# Altium schematic sheet IN-14 Breakout Board.SchDoc: Direct Drive Breakout for IN-14
size Tabloid; DrawnBy: M. Spinks; Revision: 1.0; SheetNumber: 1
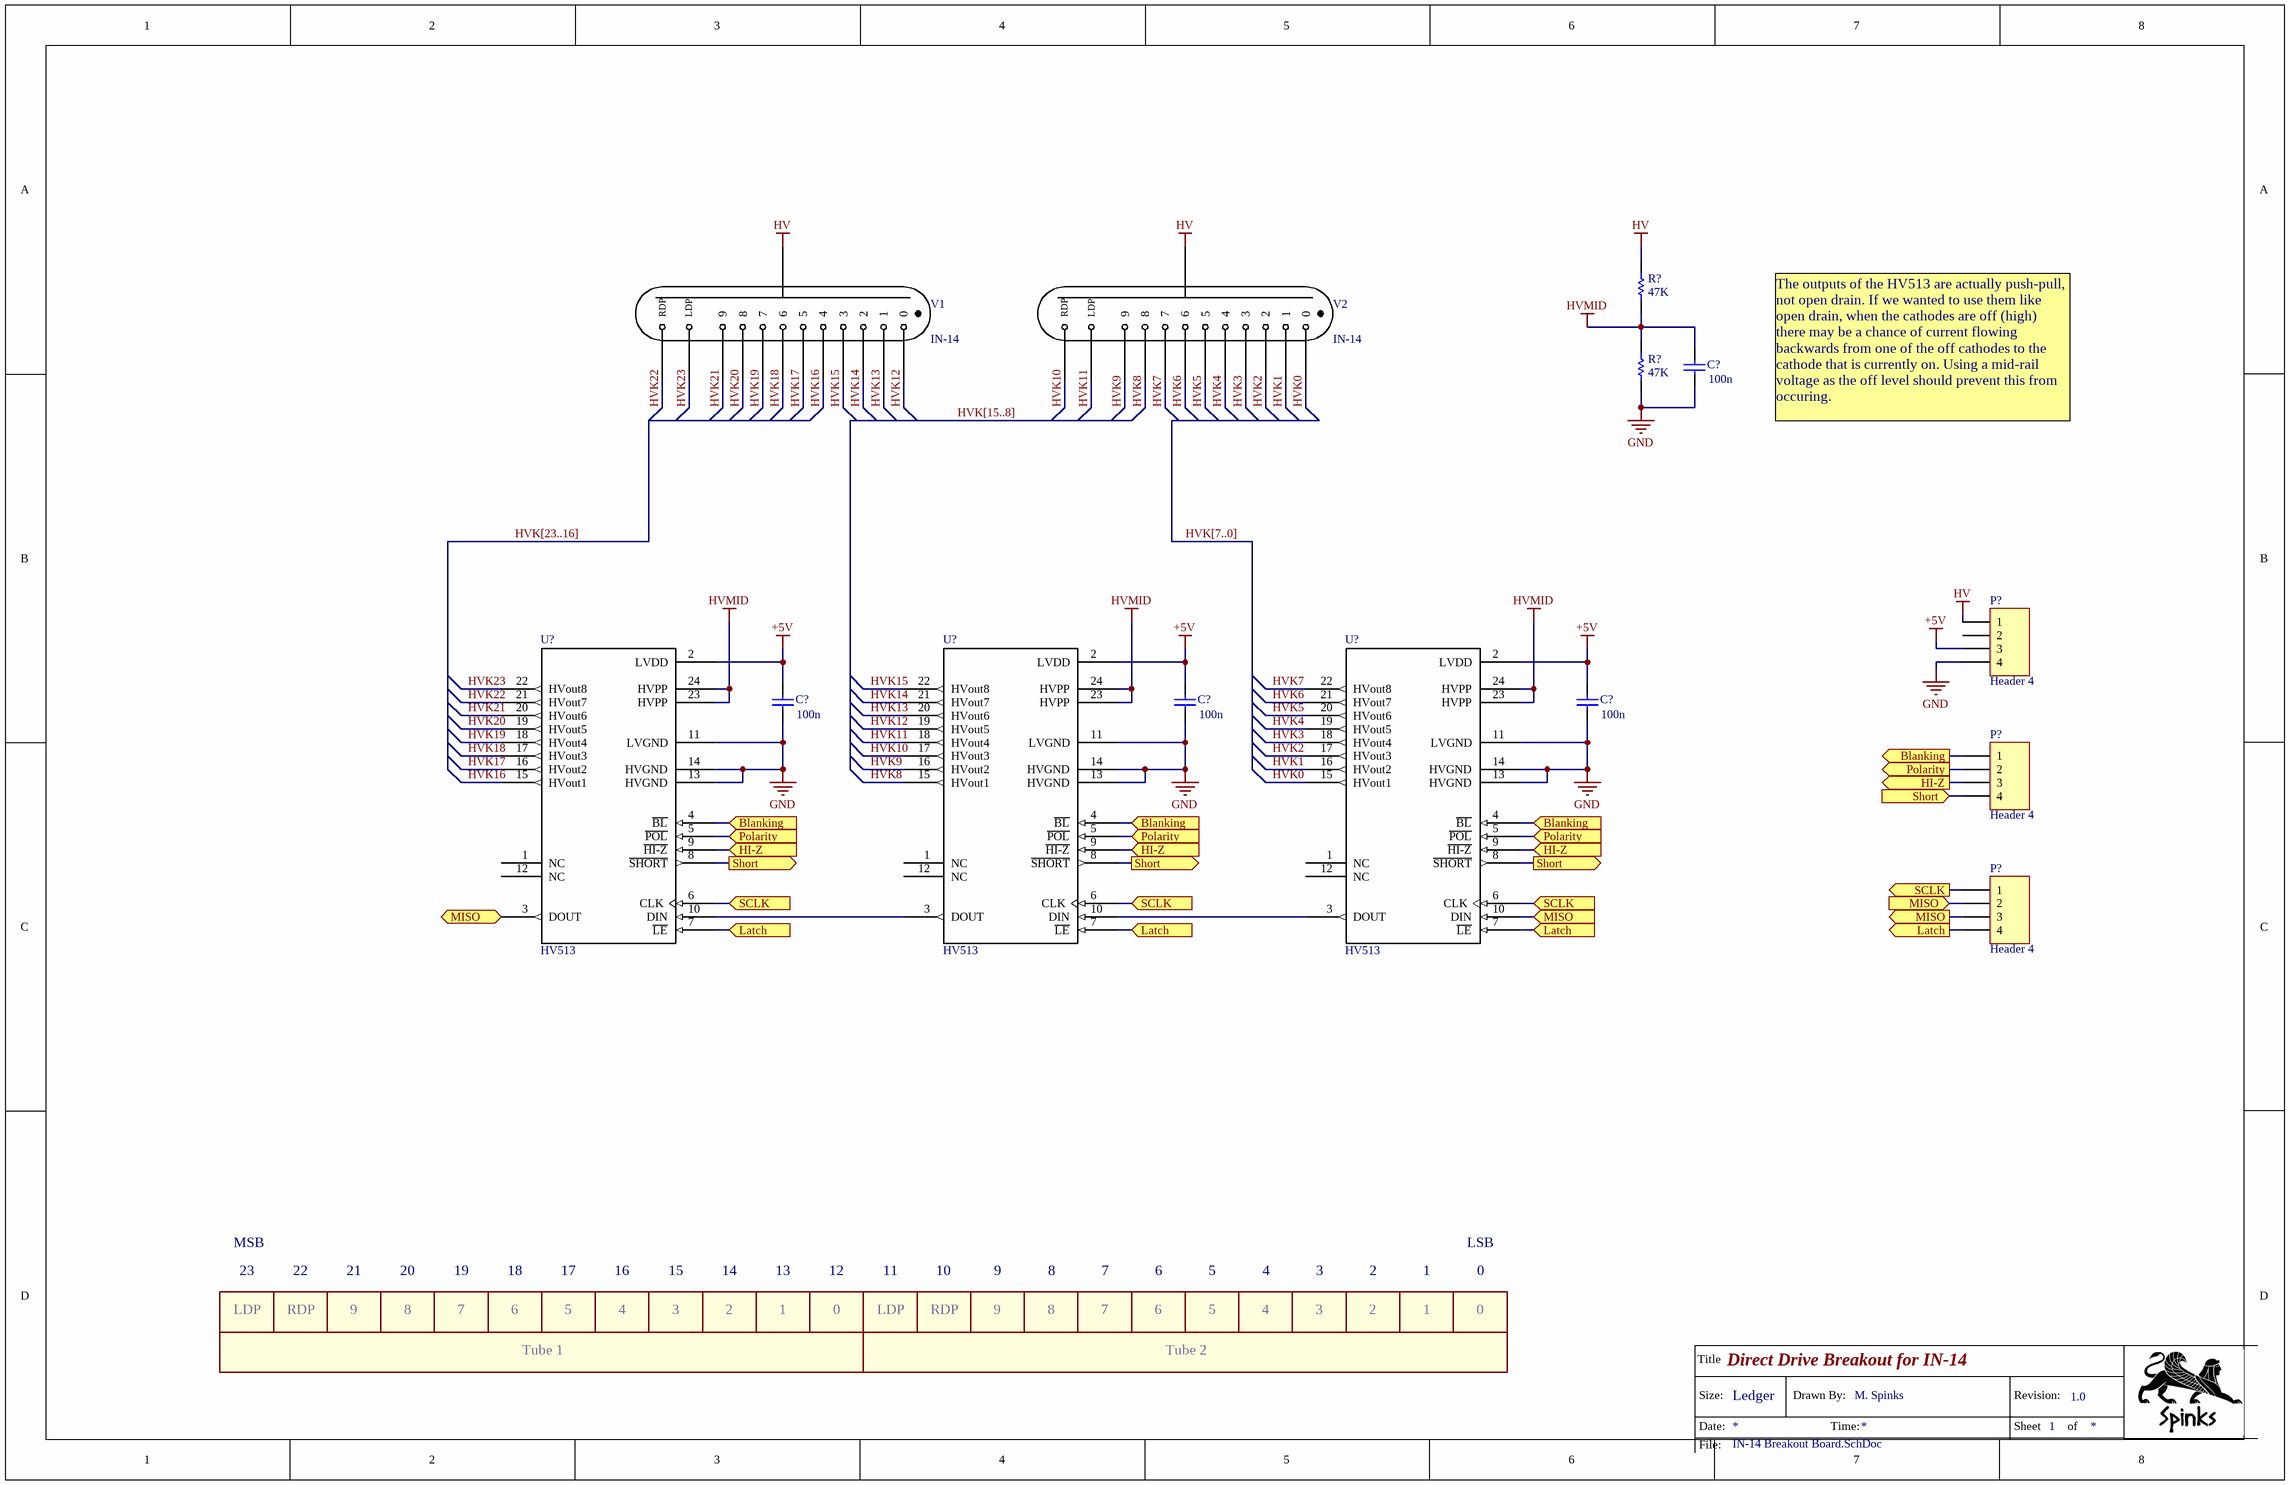
[diagram p0: IN-14 Breakout Board.SchDoc]

## Parts
(Parts that share a designator on the sheet are numbered #1, #2 ... from top to bottom, then left to right.)
C?#1  value 100n  [RAD-0.3]  (hidden comment: Cap)
C?#2  value 100n  [RAD-0.3]  (hidden comment: Cap)
C?#3  value 100n  [RAD-0.3]  (hidden comment: Cap)
C?#4  value 100n  [RAD-0.3]  (hidden comment: Cap)
P?#1  Header 4  [HDR1X4]
P?#2  Header 4  [HDR1X4]
P?#3  Header 4  [HDR1X4]
R?#1  value 47K  [AXIAL-0.3]  (hidden comment: Res1)
R?#2  value 47K  [AXIAL-0.3]  (hidden comment: Res1)
U?#1  HV513  [SOIC127P-24W]
U?#2  HV513  [SOIC127P-24W]
U?#3  HV513  [SOIC127P-24W]
V1  IN-14  [IN-14]
V2  IN-14  [IN-14]

## Ports
Blanking (in), Blanking (out), HI-Z (in), HI-Z (out), Latch (in), Latch (out), MISO (in), MISO (out), Polarity (in), Polarity (out), SCLK (in), SCLK (out), Short (in), Short (out)

## Nets
+5V: C?#2.2 C?#3.2 C?#4.2 P?#1.3 U?#1.2(LVDD) U?#2.2(LVDD) U?#3.2(LVDD)
GND: C?#1.1 C?#2.1 C?#3.1 C?#4.1 P?#1.4 R?#2.1 U?#1.11(LVGND) U?#1.13(HVGND) U?#1.14(HVGND) U?#2.11(LVGND) U?#2.13(HVGND) U?#2.14(HVGND) U?#3.11(LVGND) U?#3.13(HVGND) U?#3.14(HVGND)
HV: P?#1.1 R?#1.2 V1.A V2.A
HVMID: C?#1.2 R?#1.1 R?#2.2 U?#1.23(HVPP) U?#1.24(HVPP) U?#2.23(HVPP) U?#2.24(HVPP) U?#3.23(HVPP) U?#3.24(HVPP)
Blanking: P?#2.1 U?#1.4(~{BL}) U?#2.4(~{BL}) U?#3.4(~{BL}) ; port Blanking
HI-Z: P?#2.3 U?#1.9(~{HI-Z}) U?#2.9(~{HI-Z}) U?#3.9(~{HI-Z}) ; port HI-Z
HVK0: U?#3.15(HVout1) V2.K0(0)
HVK1: U?#3.16(HVout2) V2.K1(1)
HVK2: U?#3.17(HVout3) V2.K2(2)
HVK3: U?#3.18(HVout4) V2.K3(3)
HVK4: U?#3.19(HVout5) V2.K4(4)
HVK5: U?#3.20(HVout6) V2.K5(5)
HVK6: U?#3.21(HVout7) V2.K6(6)
HVK7: U?#3.22(HVout8) V2.K7(7)
HVK8: U?#2.15(HVout1) V2.K8(8)
HVK9: U?#2.16(HVout2) V2.K9(9)
HVK10: U?#2.17(HVout3) V2.RDP
HVK11: U?#2.18(HVout4) V2.LDP
HVK12: U?#2.19(HVout5) V1.K0(0)
HVK13: U?#2.20(HVout6) V1.K1(1)
HVK14: U?#2.21(HVout7) V1.K2(2)
HVK15: U?#2.22(HVout8) V1.K3(3)
HVK16: U?#1.15(HVout1) V1.K4(4)
HVK17: U?#1.16(HVout2) V1.K5(5)
HVK18: U?#1.17(HVout3) V1.K6(6)
HVK19: U?#1.18(HVout4) V1.K7(7)
HVK20: U?#1.19(HVout5) V1.K8(8)
HVK21: U?#1.20(HVout6) V1.K9(9)
HVK22: U?#1.21(HVout7) V1.RDP
HVK23: U?#1.22(HVout8) V1.LDP
Latch: P?#3.4 U?#1.7(~{LE}) U?#2.7(~{LE}) U?#3.7(~{LE}) ; port Latch
MISO: P?#3.2 P?#3.3 U?#1.3(DOUT) U?#3.10(DIN) ; port MISO
Polarity: P?#2.2 U?#1.5(~{POL}) U?#2.5(~{POL}) U?#3.5(~{POL}) ; port Polarity
SCLK: P?#3.1 U?#1.6(CLK) U?#2.6(CLK) U?#3.6(CLK) ; port SCLK
Short: P?#2.4 U?#1.8(~{SHORT}) U?#2.8(~{SHORT}) U?#3.8(~{SHORT}) ; port Short
NetU?#1_10: U?#1.10(DIN) U?#2.3(DOUT)
NetU?#2_10: U?#2.10(DIN) U?#3.3(DOUT)

Not connected (* = marked no-connect by the designer): P?#1 2; U?#1 1(NC) 12(NC); U?#2 1(NC) 12(NC); U?#3 1(NC) 12(NC)

## Buses and harness runs
bus HVK[7..0]
bus HVK[15..8]
bus HVK[23..16]

## Notes on the sheet
- The outputs of the HV513 are actually push-pull, not open drain. If we wanted to use them like open drain, when the cathodes are off (high) there may be a chance of current flowing backwards from one of the off cathodes to the cathode that is currently on. Using a mid-rail voltage as the off level should prevent this from occuring.
- MSB
- 23
- 22
- 21
- 20
- 19
- 18
- 17
- 16
- 15
- 14
- 13
- 12
- 11
- 10
- 9
- 8
- 7
- 6
- 5
- 4
- 3
- 2
- 1
- LSB
- 0
- LDP
- RDP
- Tube 1
- Tube 2
- Title
- Size:
- Date:
- Ledger
- Drawn By:
- Time:
- Revision:
- Sheet
- of
- File:

## Library data of the parts
C?#1-C?#4 = Cap: Capacitor; Published: 8-Jun-2000; LatestRevisionDate: 17-Jul-2002; LatestRevisionNote: Re-released for DXP Platform.; PackageReference: RAD-0.3; Publisher: Altium Limited; PackageDescription: Radial Cap, Thru-Hole; 2 Leads; 0.3 in Pin Spacing
P?#1-P?#3 = Header 4: Header, 4-Pin; LatestRevisionDate: 17-Jul-2002; LatestRevisionNote: Re-released for DXP Platform.; Publisher: Altium Limited
R?#1 R?#2 = Res1: Resistor; Published: 8-Jun-2000; LatestRevisionDate: 17-Jul-2002; LatestRevisionNote: Re-released for DXP Platform.; PackageReference: AXIAL-0.3; Publisher: Altium Limited; PackageDescription: Axial Device, Thru-Hole; 2 Leads; 0.3 in Pin Spacing
U?#1-U?#3 = HV513: 8 Channel High Voltage Serial-to-Parallel Converter
V1 V2 = IN-14: IN-14 Russian Nixie Tube